# EAGLE design elka (EAGLE 7.5.0)
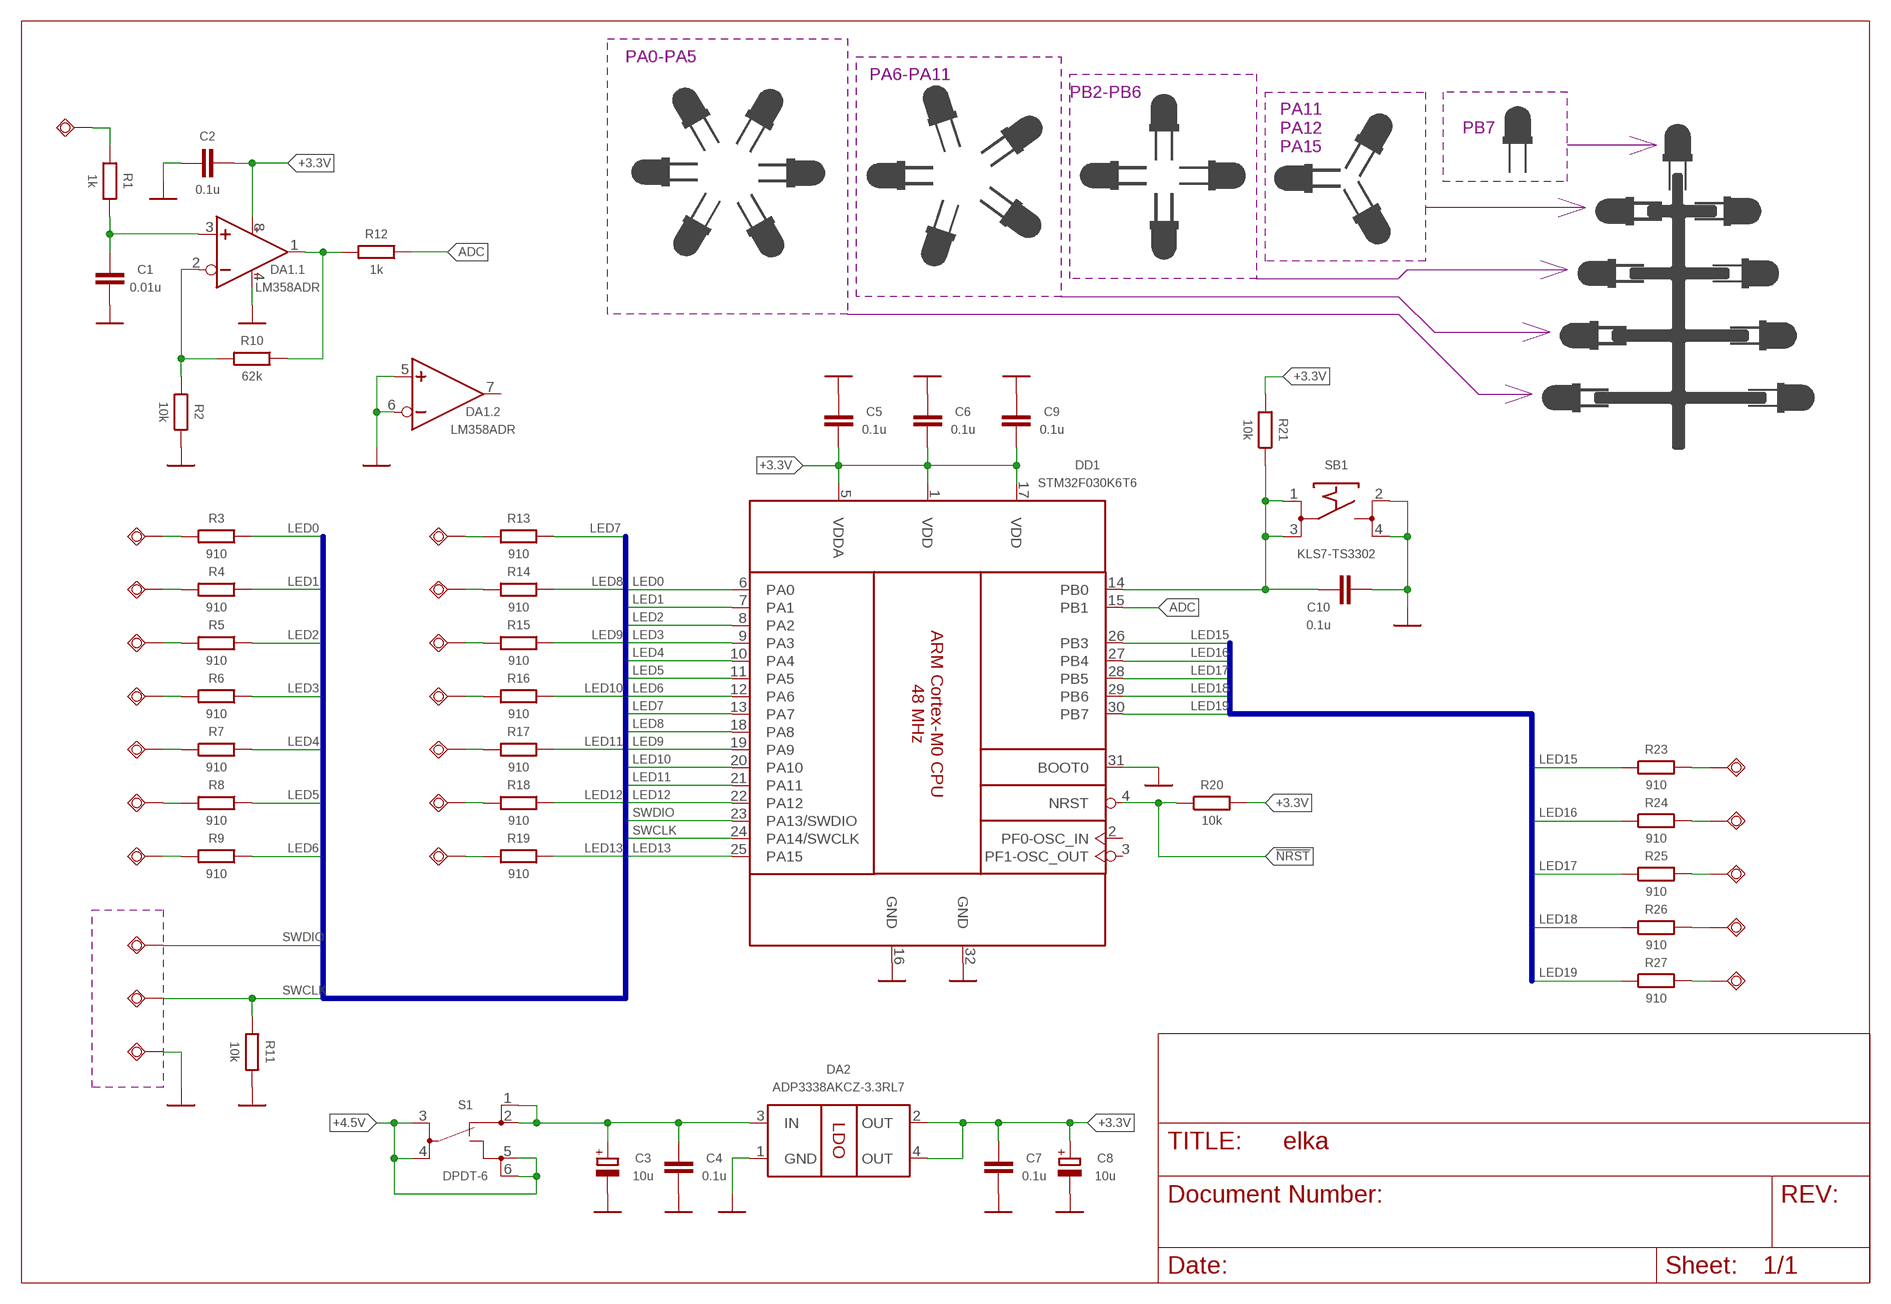
[diagram p0: schematic, sheet 1]

## Parts
C1  0.01u  C0603  [SMD0603]
C2  0.1u  C0603  [SMD0603]
C3  10u  CPOLSMC_B  [SMC_B]
C4  0.1u  C0603  [SMD0603]
C5  0.1u  C0603  [SMD0603]
C6  0.1u  C0603  [SMD0603]
C7  0.1u  C0603  [SMD0603]
C8  10u  CPOLSMC_B  [SMC_B]
C9  0.1u  C0603  [SMD0603]
C10  0.1u  C0603  [SMD0603]
DA1  LM358ADR  [SOIC8]
DA2  ADP3338AKCZ-3.3RL7  [SOT223-W]
DD1  STM32F030K6T6  [LQFP32]
R1  1k  R0603  [SMD0603]
R2  10k  R0603  [SMD0603]
R3  910  R0603  [SMD0603]
R4  910  R0603  [SMD0603]
R5  910  R0603  [SMD0603]
R6  910  R0603  [SMD0603]
R7  910  R0603  [SMD0603]
R8  910  R0603  [SMD0603]
R9  910  R0603  [SMD0603]
R10  62k  R0603  [SMD0603]
R11  10k  R0603  [SMD0603]
R12  1k  R0603  [SMD0603]
R13  910  R0603  [SMD0603]
R14  910  R0603  [SMD0603]
R15  910  R0603  [SMD0603]
R16  910  R0603  [SMD0603]
R17  910  R0603  [SMD0603]
R18  910  R0603  [SMD0603]
R19  910  R0603  [SMD0603]
R20  10k  R0603  [SMD0603]
R21  10k  R0603  [SMD0603]
R23  910  R0603  [SMD0603]
R24  910  R0603  [SMD0603]
R25  910  R0603  [SMD0603]
R26  910  R0603  [SMD0603]
R27  910  R0603  [SMD0603]
S1  DPDT-6  [DPDT]
SB1  KLS7-TS3302  [KLS7-TS3302]
TP1  TPSQTP20R  [TP20R]
TP2  TPSQTP20R  [TP20R]
TP3  TPSQTP20R  [TP20R]
TP4  TPSQTP20R  [TP20R]
TP5  TPSQTP20R  [TP20R]
TP6  TPSQTP20R  [TP20R]
TP7  TPSQTP20R  [TP20R]
TP8  TPSQTP20R  [TP20R]
TP9  TPSQTP20R  [TP20R]
TP10  TPSQTP20R  [TP20R]
TP11  TPSQTP20R  [TP20R]
TP12  TPSQTP20R  [TP20R]
TP13  TPSQTP20R  [TP20R]
TP14  TPSQTP20R  [TP20R]
TP15  TPSQTP20R  [TP20R]
TP16  TPSQTP20R  [TP20R]
TP17  TPSQTP20R  [TP20R]
TP19  TPSQTP20R  [TP20R]
TP20  TPSQTP20R  [TP20R]
TP21  TPSQTP20R  [TP20R]
TP22  TPSQTP20R  [TP20R]
TP23  TPSQTP20R  [TP20R]
TP24  TPSQTP20R  [TP20R]

## Nets
!NRST: DD1.4(NRST) R20.1
+3.3V: C2.2 C5.2 C6.2 C7.1 C8.+ C9.2 DA1.8(VCC+) DA2.2(OUT) DA2.4(OUT) DD1.1(VDD) DD1.5(VDDA) DD1.17(VDD) R20.2 R21.2
+4.5V: S1.3 S1.4 S1.5 S1.6
ADC: DD1.15(PB1) R12.1
GND: C1.2 C2.1 C3.- C4.2 C5.1 C6.1 C7.2 C8.- C9.1 C10.2 DA1.4(VCC-) DA1.5(.2:IN+) DA1.6(.2:IN-) DA2.1(GND) DD1.16(GND) DD1.31(BOOT0) DD1.32(GND) R2.1 R11.2 SB1.2 SB1.4 TP1.TP
LED0: DD1.6(PA0) R3.1
LED1: DD1.7(PA1) R4.1
LED2: DD1.8(PA2) R5.1
LED3: DD1.9(PA3) R6.1
LED4: DD1.10(PA4) R7.1
LED5: DD1.11(PA5) R8.1
LED6: DD1.12(PA6) R9.1
LED7: DD1.13(PA7) R13.1
LED8: DD1.18(PA8) R14.1
LED9: DD1.19(PA9) R15.1
LED10: DD1.20(PA10) R16.1
LED11: DD1.21(PA11) R17.1
LED12: DD1.22(PA12) R18.1
LED13: DD1.25(PA15) R19.1
LED15: DD1.26(PB3) R23.1
LED16: DD1.27(PB4) R24.1
LED17: DD1.28(PB5) R25.1
LED18: DD1.29(PB6) R26.1
LED19: DD1.30(PB7) R27.1
N$1: R14.2 TP2.TP
N$2: C1.1 DA1.3(.1:IN+) R1.1
N$3: R15.2 TP3.TP
N$4: R16.2 TP4.TP
N$5: R17.2 TP5.TP
N$6: R18.2 TP6.TP
N$7: DA1.2(.1:IN-) R2.2 R10.2
N$8: R19.2 TP9.TP
N$9: DA1.1(.1:OUT) R10.1 R12.2
N$10: R3.2 TP10.TP
N$11: R4.2 TP11.TP
N$12: R5.2 TP12.TP
N$13: R6.2 TP13.TP
N$14: R7.2 TP14.TP
N$15: R8.2 TP15.TP
N$16: R13.2 TP17.TP
N$17: R9.2 TP16.TP
N$18: C3.+ C4.1 DA2.3(IN) S1.1 S1.2
N$19: R23.2 TP19.TP
N$20: R24.2 TP20.TP
N$21: R25.2 TP21.TP
N$22: R26.2 TP22.TP
N$23: R27.2 TP23.TP
N$24: C10.1 DD1.14(PB0) R21.1 SB1.1 SB1.3
N$26: R1.2 TP24.TP
SWCLK: DD1.24(PA14/SWCLK) R11.1 TP8.TP
SWDIO: DD1.23(PA13/SWDIO) TP7.TP
Unconnected: DA1.7(.2:OUT) DD1.2(PF0-OSC_IN) DD1.3(PF1-OSC_OUT)

## Buses
LED[0..13],SWDIO,SWCLK
LED[14..19]

## Notes on the sheet
- PA0-PA5
- PA6-PA11
- PB2-PB6
- PA11
  PA12
  PA15
- PB7

## Library data of the parts
C1 C2 C4-C7 C9 C10 = common-rcl:C
C3 C8 = common-rcl:CPOL
DA1 = texas-instruments:LM358
DA2 = analog-devices:ADP3338
DD1 = st-microelectronics:STM32F030K6T6
R1-R21 R23-R27 = common-rcl:R
S1 = other:DPDT-6
SB1 = other:KLS7-TS3302
TP1-TP17 TP19-TP24 = testpad:TPSQ: Test pad

## Board
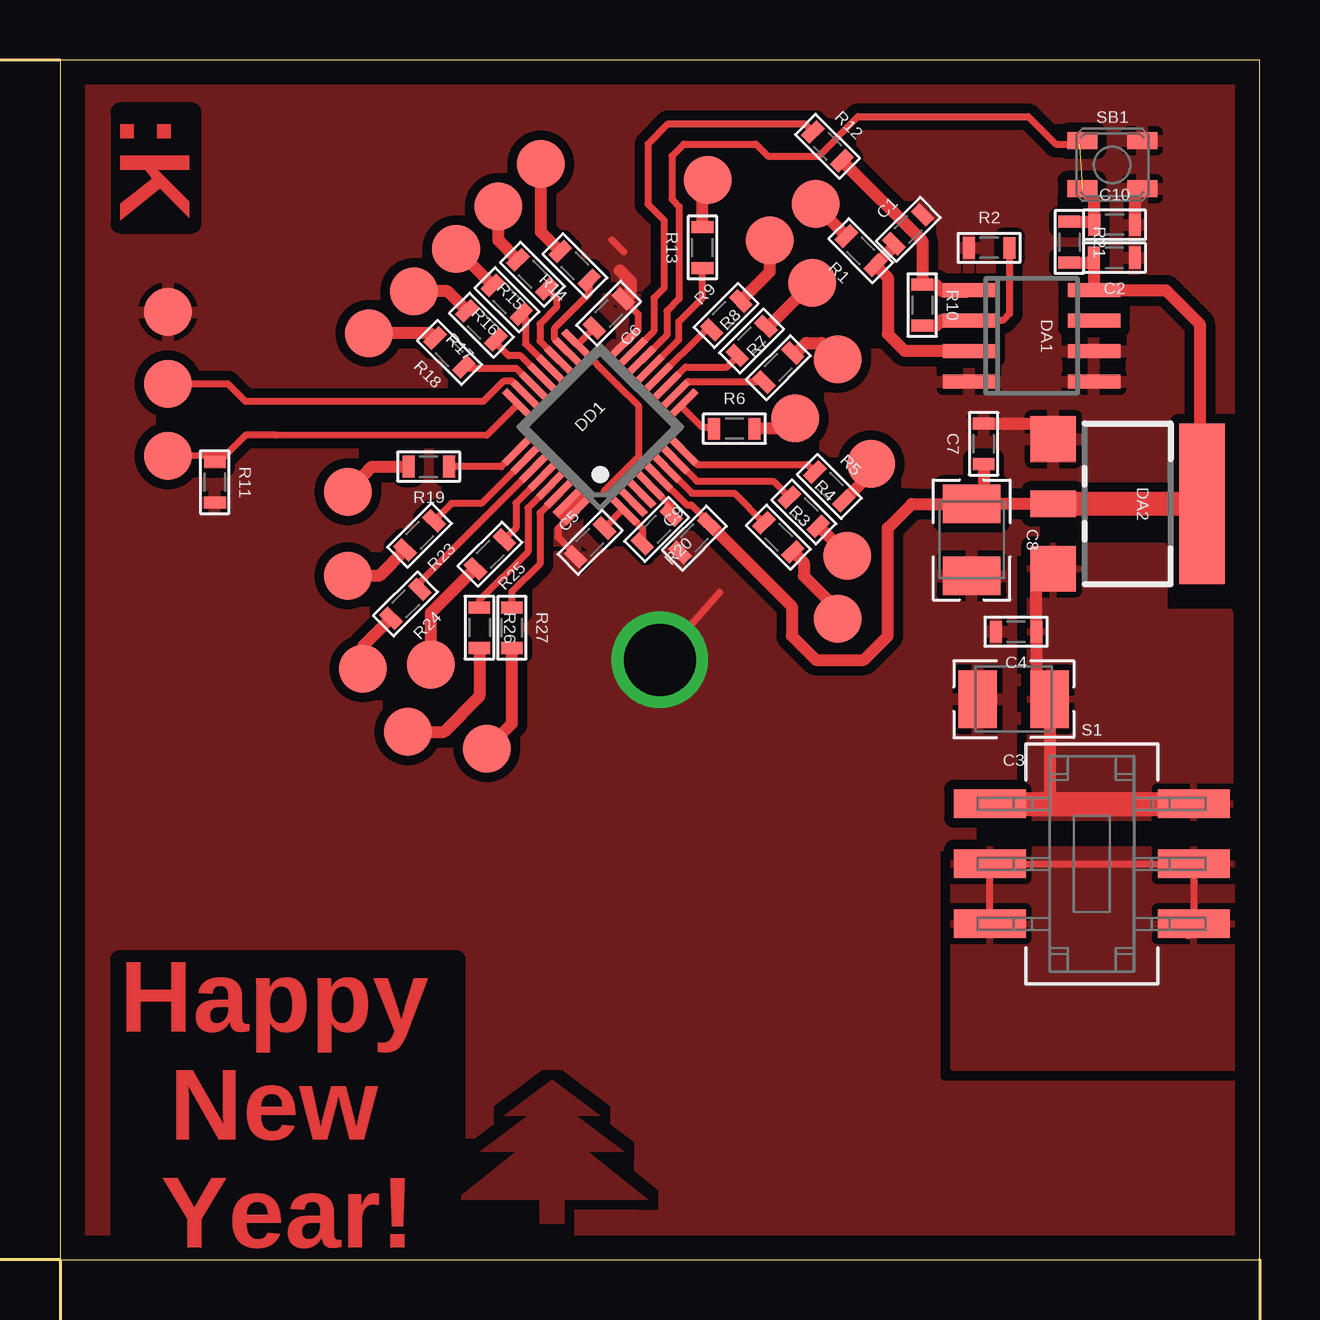
[diagram p1: board, top side]

Size 50 x 50 mm. Coordinates in mm from the lower left corner, seen from the top.
Outline: 0,0 50,0 50,50 0,50 0,0
Copper layers (1*16): Top 0.035mm / dielectric 1.5mm / Bottom 0.035mm
Design rules "default": minimum track width 10mil, minimum drill 24mil, track to track 8mil, track to pad 8mil, pad to pad 8mil, via to via 8mil, smd to smd 8mil, copper to edge 40mil, drill to drill 8mil, minimum pad ring 10mil, minimum via ring 8mil, stop-mask expansion 4mil, vias tented up to drill 0mil, thermal gap 10mil
Milling: area -4.3,0 to -3.7,1.5; area -4.3,48.5 to -3.7,50; area -6.2,23.6 to -4.4,26.4; area 48.5,-4.3 to 50,-3.7; area 0,-4.3 to 1.5,-3.7; area 23.6,-6.2 to 26.4,-4.4; 6 lines

### Footprints (pad centres in the part's own frame; a part is rotated, then mirrored left to right if it is on the bottom)
SMD0603 = smd 0.5 x 0.9: 1 -0.85,0; 2 0.85,0
SMC_B = smd 1.6 x 2.4: + -1.5,0; - 1.5,0
SOIC8 = smd 0.6 x 2.2: 1 -1.905,-2.6; 2 -0.635,-2.6; 3 0.635,-2.6; 4 1.905,-2.6; 5 1.905,2.6; 6 0.635,2.6; 7 -0.635,2.6; 8 -1.905,2.6
SOT223-W = smd 1.9 x 1.9: 1 -2.7,-3.1; 3 2.7,-3.1 | smd 1.1 x 1.9: 2 0,-3.1 | smd 6.7 x 1.9: 4 0,3.1
LQFP32 = smd 0.3 x 1.6: 1 -1.75,-3.1; 2 -1.25,-3.1; 3 -0.75,-3.1; 4 -0.25,-3.1; 5 0.25,-3.1; 6 0.75,-3.1; 7 1.25,-3.1; 8 1.75,-3.1; 17 1.75,3.1; 18 1.25,3.1; 19 0.75,3.1; 20 0.25,3.1; 21 -0.25,3.1; 22 -0.75,3.1; 23 -1.25,3.1; 24 -1.75,3.1 | smd 1.6 x 0.3: 9 3.1,-1.75; 10 3.1,-1.25; 11 3.1,-0.75; 12 3.1,-0.25; 13 3.1,0.25; 14 3.1,0.75; 15 3.1,1.25; 16 3.1,1.75; 25 -3.1,1.75; 26 -3.1,1.25; 27 -3.1,0.75; 28 -3.1,0.25; 29 -3.1,-0.25; 30 -3.1,-0.75; 31 -3.1,-1.25; 32 -3.1,-1.75
DPDT = smd 1.2 x 3: 1 -2.5,-4.25; 2 -2.5,4.25; 3 0,-4.25; 4 0,4.25; 5 2.5,-4.25; 6 2.5,4.25
KLS7-TS3302 = smd 1.25 x 0.7: 1 -1.25,1; 2 1.25,1; 3 -1.25,-1; 4 1.25,-1
TP20R = smd 2 x 2: TP 0,0

### Placement (x,y rotation side)
C1  35.36,42.94 45 top
C2  43.95,41.76 180 top
C3  39.75,23.36 180 top
C4  39.85,26.17 180 top
C5  22.1,29.89 45 top
C6  22.87,39.44 225 top
C7  38.5,34 90 top
C8  38,30 270 top
C9  26.45,30.07 45 top
C10  43.96,43.13 0 top
DA1  40.5,38.5 270 top
DA2  44.5,31.5 270 top
DD1  22.52,34.7 45 top
R1  33.38,42.05 135 top
R2  38.73,42.17 0 top
R3  29.95,30.1 315 top
R4  31.01,31.17 315 top
R5  32.07,32.23 315 top
R6  28.11,34.63 0 top
R7  29.95,37.18 45 top
R8  28.83,38.29 45 top
R9  27.77,39.35 45 top
R10  35.94,39.78 270 top
R11  6.45,32.4 270 top
R12  31.99,46.4 315 top
R13  26.78,42.18 90 top
R14  21.46,41.42 135 top
R15  19.69,41.06 135 top
R16  18.63,40 135 top
R17  17.57,38.94 135 top
R18  16.23,37.81 135 top
R19  15.37,33.05 180 top
R20  24.87,30.43 225 top
R21  42.07,42.41 270 top
R23  14.99,30.19 225 top
R24  14.4,27.33 225 top
R25  17.92,29.4 225 top
R26  17.49,26.34 270 top
R27  18.83,26.33 270 top
S1  43,16.5 270 top
SB1  43.86,45.63 0 top
TP1  4.5,39.5 0 top
TP2  20.05,45.66 45 top
TP3  18.28,43.89 45 top
TP4  16.51,42.13 45 top
TP5  14.74,40.36 45 top
TP6  12.87,38.61 45 top
TP7  4.5,36.5 45 top
TP8  4.5,33.5 45 top
TP9  12,32 45 top
TP10  32.41,26.71 45 top
TP11  32.82,29.34 45 top
TP12  33.82,33.17 45 top
TP13  30.65,35.05 45 top
TP14  32.42,37.53 45 top
TP15  31.36,40.71 45 top
TP16  29.59,42.48 45 top
TP17  27,45 45 top
TP19  12,28.5 45 top
TP20  12.62,24.63 45 top
TP21  15.45,24.8 45 top
TP22  14.5,22 45 top
TP23  17.8,21.3 45 top
TP24  31.5,44 270 top

### Tracks (layer width: path | path; a pad name or v marks a point on that pad's centre or on a via)
!NRST
  Top 0.3: DD1.4 25.48,31.39 R20.1
+3.3V
  Top 0.3: DD1.1 C5.2 | C6.2 DD1.17 23.23,36.47 24.11,35.59 24.11,33.46 | 24.11,33.46 DD1.5 26.13,31.45 26.32,31.45 27.05,30.72 C9.2 | DD1.1 22.7,32.05 24.11,33.46 | DD1.1 24.27,30.47 R20.2
  Top 0.5: C7.1 38.5,32 C8.+ | DA2.2 C8.+ | 47.5,28.5 47.5,31.4 | 47.5,31.4 DA2.4 | C2.2 43.1,41.87 | C2.2 DA1.8 46.09,40.41 47.5,39 47.5,31.4 | R21.2 42.9,41.56 C2.2 | C9.2 30.5,27.22 30.5,26 31.5,25 33.5,25 34.5,26 34.5,30.5 35.5,31.5 C8.+
  Top 1: DA2.4 DA2.2
+4.5V
  Top 0.3: S1.5 S1.3 S1.4 S1.6 | S1.6 47.25,13.75 arc-90 47,13.5 47,13.75 arc-90 S1.6
  pour Top: 37.25,17.1 49,17.1 49,8 37.25,8
ADC
  Top 0.3: DD1.15 24.76,38.71 24.76,40.08 25.18,40.5 25.18,43.32 24.5,44 24.5,46.5 25.34,47.34 31.07,47.34 31.07,47.32 R12.1
GND  (via drill 3)
  Top 0.3: DD1.31 DD1.32 20.75,30.46 20.75,30.11 21.5,29.36 C5.1 | 27.5,27.81 v25,25 | C6.1 23.54,40.04 | 23.7,39.81 C6.1 | 23.5,42 23,42.5 | DD1.16 24.11,38.77 24.11,39.39 23.48,40.02 C6.1
  Top 0.5: C7.2 40.75,34.85 DA2.1 | 23.54,40.04 23.6,40.04 23.8,40.24 23.8,40.77 23.34,41.23 | SB1.4 44.81,44.33 C10.2
  pour Top (isolate 0.4, rank 6): 0,0 50,0 50,50 0,50
LED0
  Top 0.3: DD1.6 26.34,31.94 28.11,31.94 R3.1
LED1
  Top 0.3: DD1.7 26.55,32.44 29.73,32.44 R4.1
LED2
  Top 0.3: DD1.8 26.55,33.15 31.15,33.15 R5.1
LED3
  Top 0.3: DD1.9 25.95,35.51 26.76,34.7 27.19,34.7 R6.1
LED4
  Top 0.3: DD1.10 26.19,36.6 29.32,36.6 arc-90 R7.1
LED5
  Top 0.3: DD1.11 26.08,37.2 27.8,37.2 28.23,37.63 R8.1
LED6
  Top 0.3: DD1.12 26.92,38.75 R9.1
LED7
  Top 0.3: DD1.13 25.8,38.33 25.8,39.1 26.78,40.08 R13.1
LED8
  Top 0.3: R14.1 22.06,40.26 20.6,38.8 20.6,38.39 DD1.18
LED9
  Top 0.3: R15.1 20.7,40.06 20.7,39.7 20,39 20,38.28 DD1.19
LED10
  Top 0.3: R16.1 19.4,39.24 19.4,38.17 DD1.20
LED11
  Top 0.3: DD1.21 19.2,37.67 18.7,37.67 18.17,38.2 R17.1
LED12
  Top 0.3: DD1.22 19.02,37.14 16.84,37.14 R18.1
LED13
  Top 0.3: DD1.25 18.39,33.05 R19.1
LED15
  Top 0.3: DD1.26 17.57,31.51 16.32,31.51 R23.1
LED16
  Top 0.3: DD1.27 15,28.25 R24.1
LED17
  Top 0.3: DD1.28 19,31.53 19,30.5 18.53,30.03 R25.1
LED18
  Top 0.3: DD1.29 19.5,31.33 19.5,29.5 17.48,27.48 R26.1
LED19
  Top 0.3: DD1.30 20,31.12 20,29 18.83,27.83 R27.1
N$1
  Top 0.5: R14.2 20.05,42.83 TP2.TP
N$2
  Top 0.5: C1.1 34.76,42.23 R1.1 34.5,40.93 34.5,38.58 35.22,37.87 DA1.3
N$3
  Top 0.5: R15.2 18.28,42.48 TP3.TP
N$4
  Top 0.5: R16.2 TP4.TP
N$5
  Top 0.5: R17.2 16.16,40.36 TP5.TP
N$6
  Top 0.5: R18.2 15.43,38.61 TP6.TP
N$7
  Top 0.3: R2.2 39.58,39.42 39.3,39.14 DA1.2
  Top 0.5: R10.2 36.54,38.93 36.78,39.17 37.87,39.17 DA1.2
N$8
  Top 0.5: TP9.TP 13.01,33.05 R19.2
N$9
  Top 0.5: DA1.1 37.84,40.35 36.8,40.35 36.52,40.63 R10.1 35.94,42.46 R12.2
N$10
  Top 0.5: R3.2 31,29.05 31,28.5 32.41,27.09 TP10.TP
N$11
  Top 0.5: R4.2 32.82,29.36 TP11.TP
N$12
  Top 0.5: R5.2 33.82,32.78 TP12.TP
N$13
  Top 0.5: TP13.TP 30.23,34.63 R6.2
N$14
  Top 0.5: R7.2 30.68,37.78 31.1,38.2 31.75,38.2 TP14.TP
N$15
  Top 0.5: R8.2 29.54,38.89 TP15.TP
N$16
  Top 0.5: R13.2 26.78,44.78 TP17.TP
N$17
  Top 0.5: R9.2 29.59,41.17 TP16.TP
N$18
  Top 0.5: DA2.3 arc90 40.7,28.1 C4.1 40.7,23.91 arc90 C3.+ 41.25,19.25 arc-90 41,19
  Top 1: S1.1 41,19 S1.2
  pour Top (isolate 0.3): 40.45,29.75 46,29.75 46,27 48.75,27 48.75,18.4 40.45,18.4
N$19
  Top 0.5: R23.2 13.3,28.5 TP19.TP
N$20
  Top 0.5: R24.2 12.62,25.55 TP20.TP
N$21
  Top 0.5: R25.2 17.3,28.8 15.45,26.95 TP21.TP
N$22
  Top 0.5: R26.2 17.48,23.48 16,22 TP22.TP
N$23
  Top 0.5: R27.2 18.83,22.33 TP23.TP
N$24  (1 unrouted)
  Top 0.3: DD1.14 25.3,38.54 25.3,39.54 25.81,40.05 25.81,43.89 25.5,44.2 25.5,46 26,46.5 29,46.5 29.5,46 31.63,46 33.27,47.64 40.36,47.64 41.5,46.5 42.48,46.5 SB1.1
  Top 0.5: R21.1 42.98,43.26 C10.1 43.11,44.13 SB1.3
N$25
  pour Top: 20,1.5 20,2.5 16.5,2.5 19,4.5 17.5,4.5 19.5,6 18.5,6 20.5,7.5 22.5,6 21.5,6 23.5,4.5 22,4.5 24.5,2.5 21,2.5 21,1.5
N$26
  Top 0.5: TP24.TP 31.5,43.93 R1.2
SWCLK
  Top 0.3: DD1.24 17.79,34.35 9,34.36 7.74,34.36 6.89,33.51 6.5,33.51 | 6.5,33.51 4.83,33.5 TP8.TP | R11.1 6.5,33.25 6.5,33.51
SWDIO
  Top 0.3: DD1.23 18.84,36.61 18.49,36.61 17.64,35.76 7.74,35.76 7,36.5 TP7.TP
(copper drawn outside any net)
  shapes: Top area x2

### Text on the board
Top: :K | Happy / New / Year!